# Altium schematic sheet POWER.SchDoc
size A4
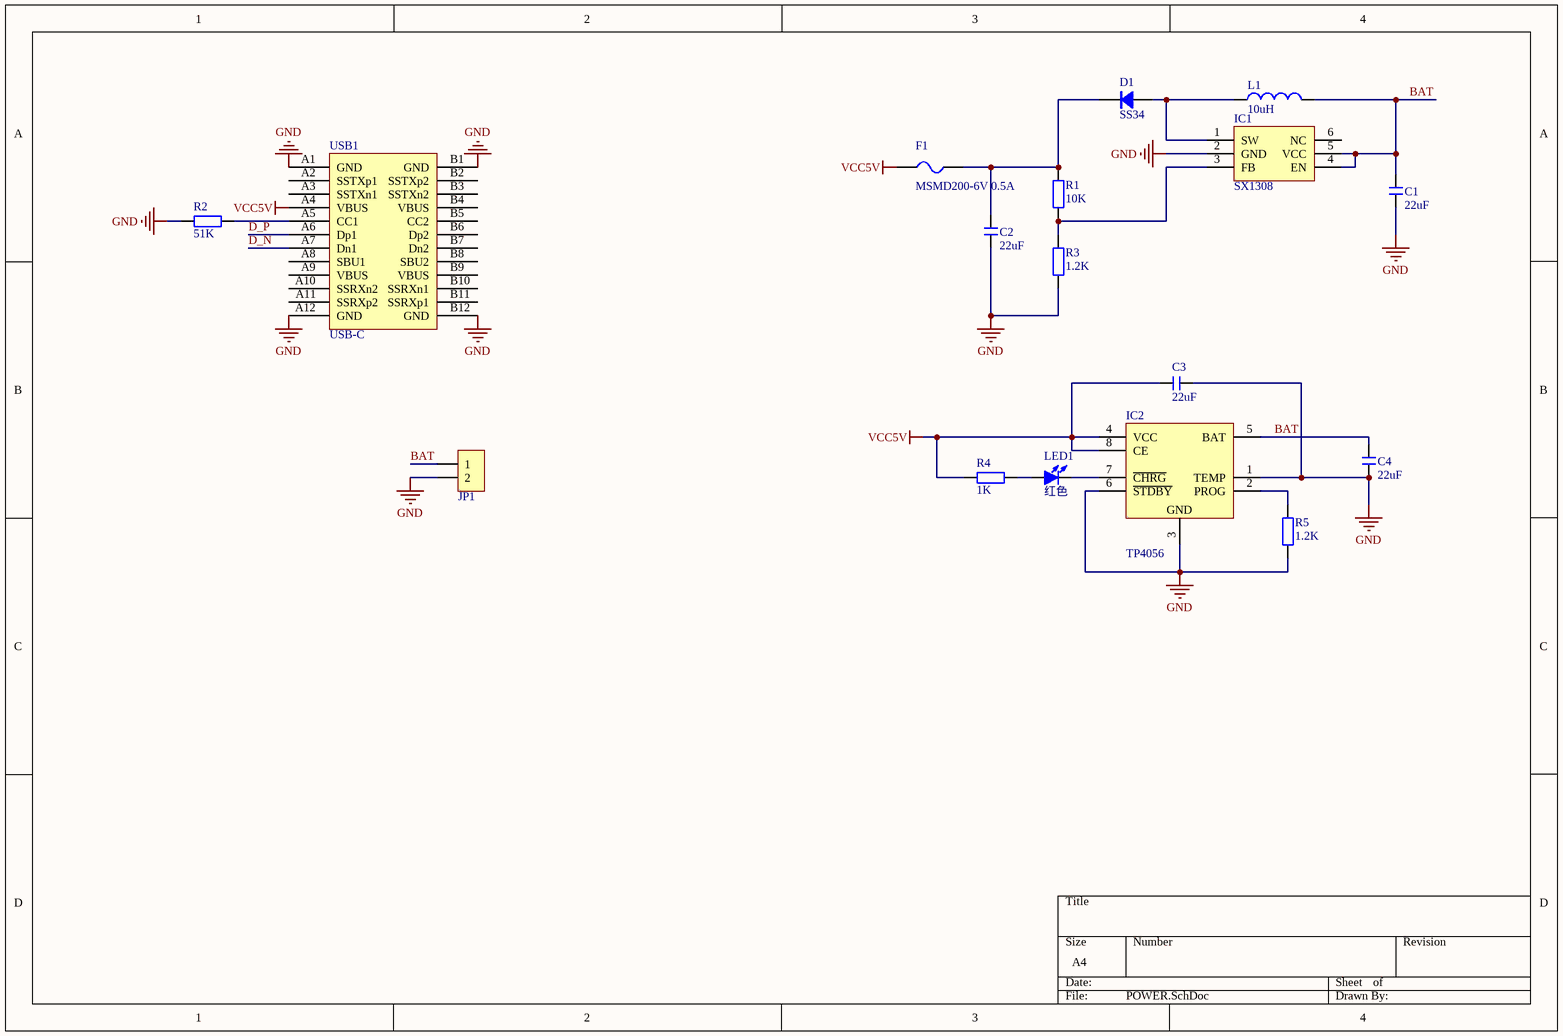
[diagram p0: POWER.SchDoc]

## Parts
C1  22uF  [C 0805_L]
C2  22uF  [C 0805_L]
C3  22uF  [C 0805_L]
C4  22uF  [C 0805_L]
D1  SS34  [SMC]
F1  MSMD200-6V 0.5A  [FU 1206]
IC1  SX1308  [SOT23-6N]
IC2  TP4056  [SOP8_N]
JP1  HDR-1X2  [XH2.54-LI-2P]  (value not drawn)
L1  10uH  [SMD,6.6x7.1x3.0mm]
LED1  红色  [LED 0603R]
R1  10K  [R 0603_L]
R2  51K  [R 0603_L]
R3  1.2K  [R 0603_L]
R4  1K  [R 0603_L]
R5  1.2K  [R 0603_L]
USB1  USB-C  [USB-C/S_A]

## Nets
GND: C1.1 C2.1 C3.1 C4.1 IC1.2(GND) IC2.1(TEMP) IC2.3(GND) IC2.6(~{STDBY}) JP1.2 R2.2 R3.1 R5.1 USB1.A1(GND) USB1.A12(GND) USB1.B1(GND) USB1.B12(GND)
VCC5V: C3.2 F1.1 IC2.4(VCC) IC2.8(CE) R4.1 USB1.A4(VBUS)
BAT: C1.2 C4.2 IC1.4(EN) IC1.5(VCC) IC2.5(BAT) JP1.1 L1.2
D_N: USB1.A7(Dn1)
D_P: USB1.A6(Dp1)
NetC2_2: C2.2 D1.2(K) F1.2 R1.2
NetD1_1: D1.1(A) IC1.1(SW) L1.1
NetIC1_3: IC1.3(FB) R1.1 R3.2
NetIC2_2: IC2.2(PROG) R5.2
NetIC2_7: IC2.7(~{CHRG}) LED1.2(K)
NetLED1_1: LED1.1(A) R4.2
NetR2_1: R2.1 USB1.A5(CC1)

Not connected (* = marked no-connect by the designer): IC1 6(NC); USB1 A2(SSTXp1) A3(SSTXn1) A8(SBU1) A9(VBUS) A10(SSRXn2) A11(SSRXp2) B2(SSTXp2) B3(SSTXn2) B4(VBUS) B5(CC2) B6(Dp2) B7(Dn2) B8(SBU2) B9(VBUS) B10(SSRXn1) B11(SSRXp1)

## Library data of the parts
C1-C4 = C: 无极性贴片电容; 版权归属: 源创客; 材质: X7R; BOM名称: 无极性贴片电容; 学习资源: www.ooocke.com
D1 = SS34: 肖特基二极管; 版权归属: 源创客; 属性: 40V/3A; BOM名称: 肖特基二极管; 学习资源: www.ooocke.com
F1 = FU: 贴片保险丝; 版权归属: 源创客; BOM名称: 贴片保险丝; 学习资源: www.ooocke.com
IC1 = SX1308: 可调升压芯片; 版权归属: 源创客; BOM名称: 可调升压芯片; 学习资源: www.ooocke.com
IC2 = TP4056: 锂电池充电管理; 版权归属: 源创客; BOM名称: 锂电池充电管理; 学习资源: www.ooocke.com
JP1 = Header 2: 2P接插件; 版权归属: 源创客; BOM名称: 2P接插件; 学习资源: www.ooocke.com
L1 = L: 小功率贴片电感; 版权归属: 源创客; BOM名称: 小功率贴片电感; 学习资源: www.ooocke.com
LED1 = LED-SMD: 贴片LED; 版权归属: 源创客; BOM名称: 贴片LED; 学习资源: www.ooocke.com
R1-R5 = R: 贴片电阻; 版权归属: 源创客; BOM名称: 贴片电阻; 学习资源: www.ooocke.com
USB1 = USB-C/S: USB-C型母接口; 版权归属: 源创客; BOM名称: USB-C型母接口; 学习资源: www.ooocke.com